# EAGLE design NQSMHS-V2.4 (EAGLE 5.10)

## Sheet 1 of 4
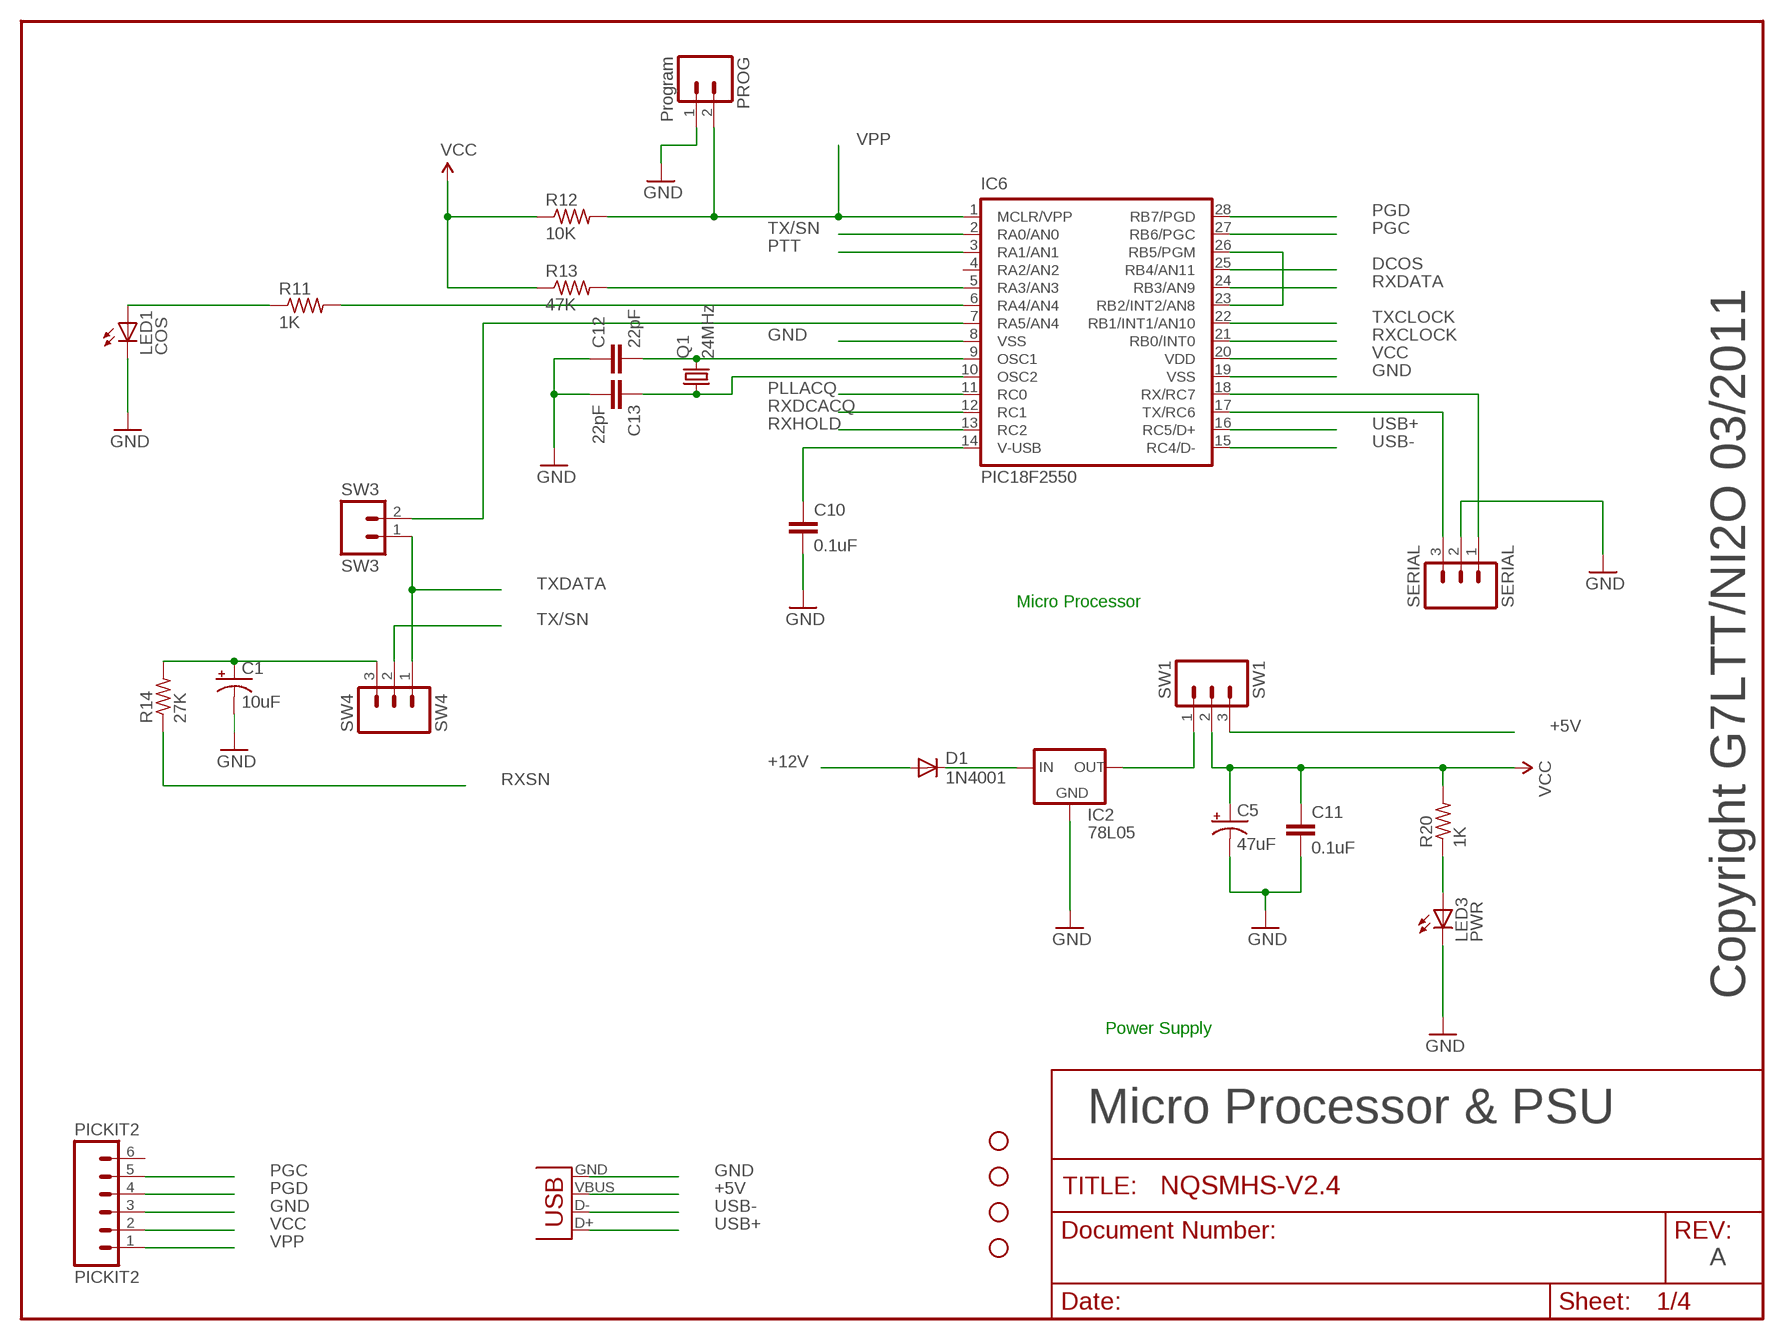
[diagram p0: schematic, sheet 1]

### Parts
C1  10uF  CAP_POLPTH2  [CPOL-RADIAL-10UF-25V]
C5  47uF  CAP_POLPTH2  [CPOL-RADIAL-10UF-25V]
C10  0.1uF  C2.5/2  [C2.5-2]
C11  0.1uF  C2.5/2  [C2.5-2]
C12  22pF  C2.5/2  [C2.5-2]
C13  22pF  C2.5/2  [C2.5-2]
D1  1N4001  DIODEPTH  [DIODE-1N4001]
IC2  78L05  78LXX  [78LXX]
IC6  PIC18F2550  [DIL28-3]
J1  USBPTH  [USB-B-PTH]
JP7  STAND-OFF  [STAND-OFF]
JP8  STAND-OFF  [STAND-OFF]
JP9  STAND-OFF  [STAND-OFF]
JP10  STAND-OFF  [STAND-OFF]
LED1  COS  LED5MM  [LED5MM]
LED3  PWR  LED5MM  [LED5MM]
PICKIT2  PICKIT2  M06SIP  [1X06]
PROG  Program  M02PTH  [1X02]
Q1  24MHz  CRYSTALHC49US  [HC49US]
R11  1K  R-US_0207/2V  [0207/2V]
R12  10K  R-US_0207/2V  [0207/2V]
R13  47K  R-US_0207/2V  [0207/2V]
R14  27K  R-US_0207/2V  [0207/2V]
R20  1K  R-US_0207/2V  [0207/2V]
SERIAL  SERIAL  M03PTH  [1X03]
SW1  SW1  M03PTH  [1X03]
SW3  SW3  M02PTH  [1X02]
SW4  SW4  M03PTH  [1X03]

### Nets
+5V: J1.VBUS SW1.3
+12V: D1.A ; also sheet 2
DCOS: IC6.25(RB4/AN11) ; also sheet 3
GND: C1.2(-) C5.2(-) C10.2 C11.2 C12.1 C13.2 IC2.GND IC6.8(VSS) IC6.19(VSS) J1.GND LED1.K(C) LED3.K(C) PICKIT2.3 PROG.1 SERIAL.2 ; also sheet 2,3,4
N$2: D1.C IC2.IN
N$3: IC6.23(RB2/INT2/AN8) IC6.26(RB5/PGM)
N$4: IC6.5(RA3/AN3) R13.2
N$5: IC6.6(RA4/AN4) R11.2
N$6: LED1.A R11.1
N$7: IC6.7(RA5/AN4) SW3.2
N$8: C1.1(+) R14.2 SW4.3
N$9: C12.2 IC6.9(OSC1) Q1.2
N$10: C13.1 IC6.10(OSC2) Q1.1
N$11: C10.1 IC6.14(V-USB)
N$12: IC2.OUT SW1.1
N$13: LED3.A R20.1
PGC: IC6.27(RB6/PGC) PICKIT2.5
PGD: IC6.28(RB7/PGD) PICKIT2.4
PLLACQ: IC6.11(RC0) ; also sheet 4
PTT: IC6.3(RA1/AN1) ; also sheet 2
RX-232: IC6.18(RX/RC7) SERIAL.1
RXCLOCK: IC6.21(RB0/INT0) ; also sheet 4
RXDATA: IC6.24(RB3/AN9) ; also sheet 4
RXDCACQ: IC6.12(RC1) ; also sheet 4
RXHOLD: IC6.13(RC2) ; also sheet 4
RXSN: R14.1 ; also sheet 3,4
TX-232: IC6.17(TX/RC6) SERIAL.3
TX/SN: IC6.2(RA0/AN0) SW4.2
TXCLOCK: IC6.22(RB1/INT1/AN10) ; also sheet 4
TXDATA: SW3.1 SW4.1 ; also sheet 4
USB+: IC6.16(RC5/D+) J1.D+
USB-: IC6.15(RC4/D-) J1.D-
VCC: C5.1(+) C11.1 IC6.20(VDD) PICKIT2.2 R12.1 R13.1 R20.2 SW1.2 ; also sheet 2,3,4
VPP: IC6.1(MCLR/VPP) PICKIT2.1 PROG.2 R12.2
Unconnected: IC6.4(RA2/AN2) PICKIT2.6

### Notes on the sheet
- Micro Processor
- Copyright G7LTT/NI2O 03/2011
- Power Supply
- Micro Processor & PSU
- A

## Sheet 2 of 4
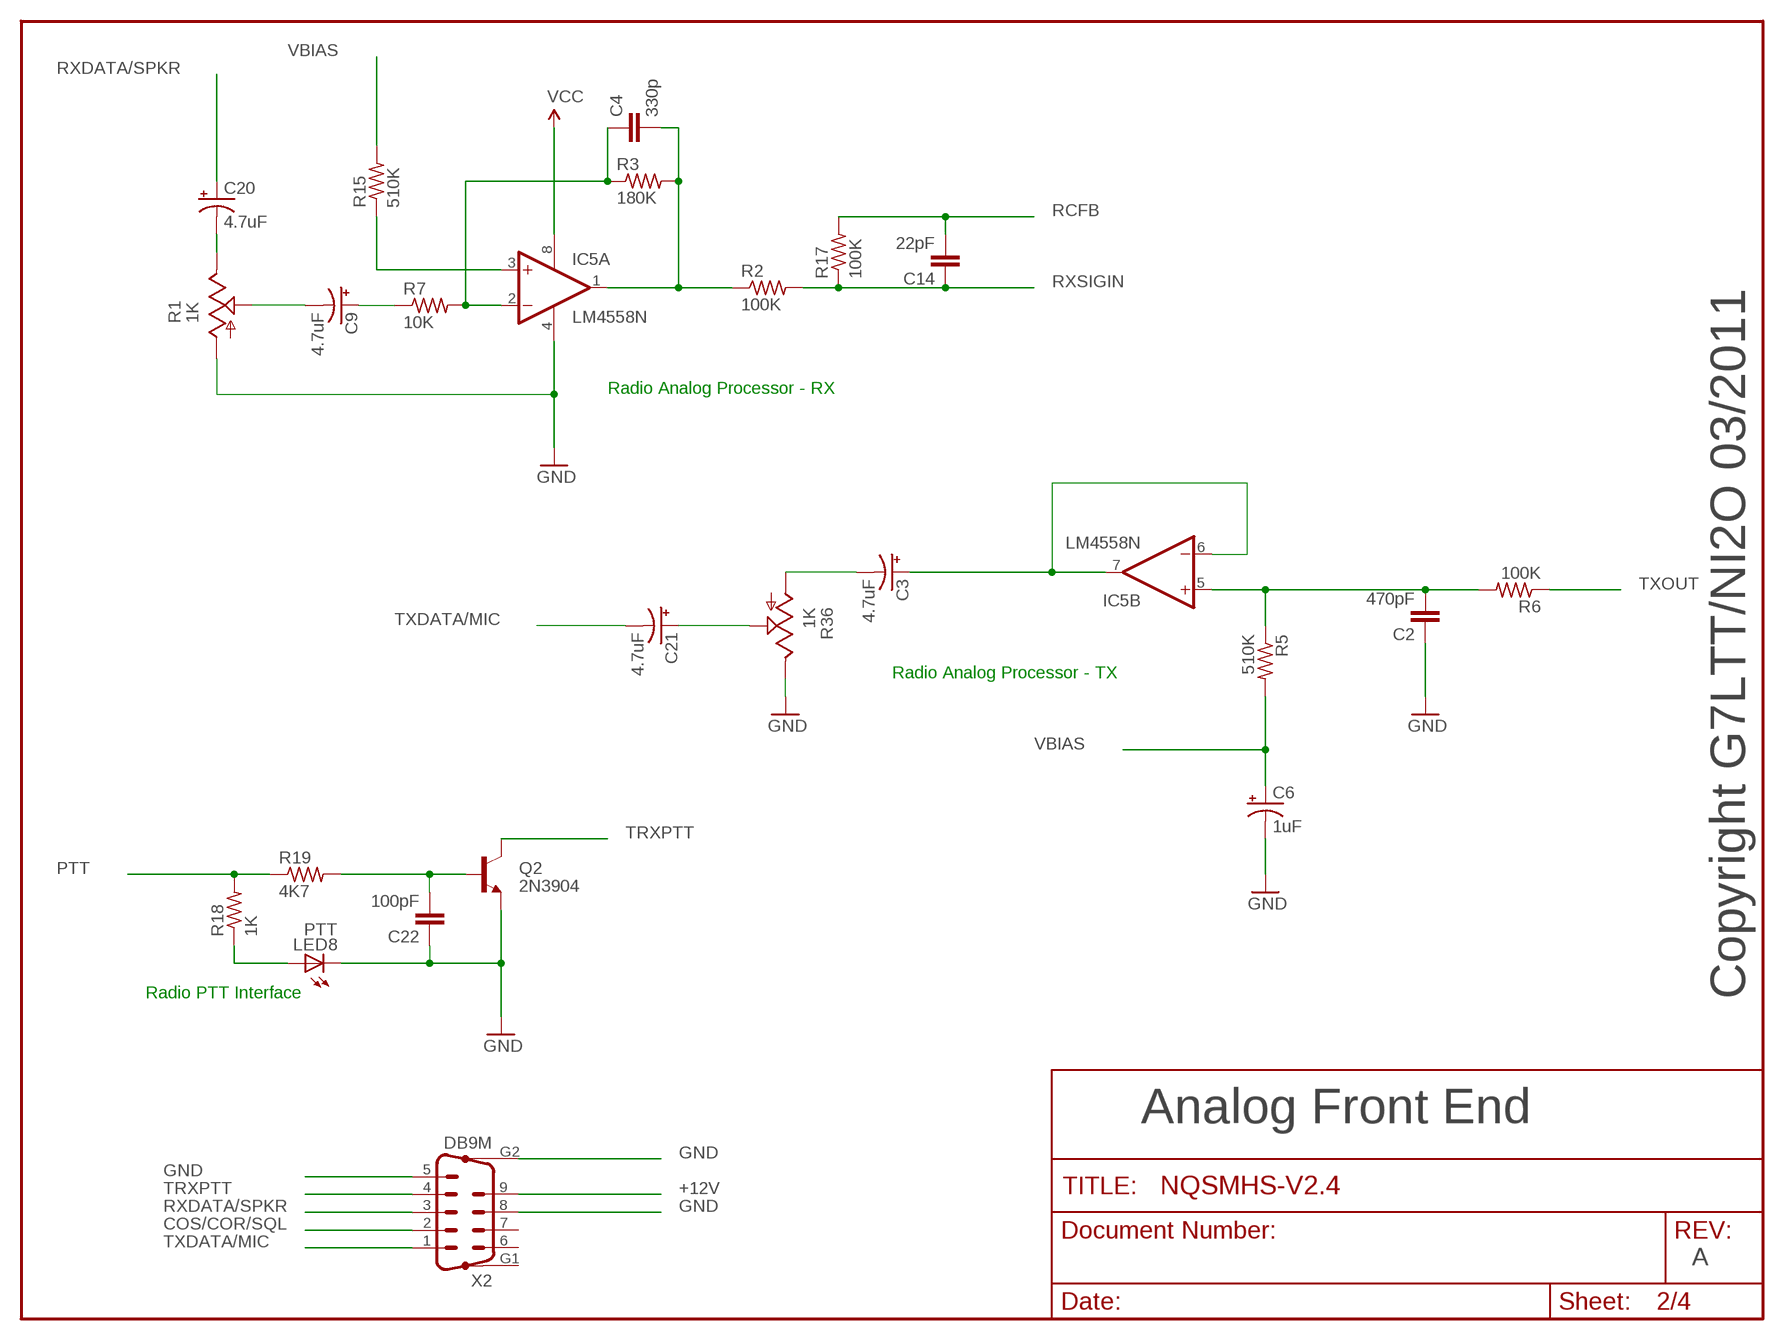
[diagram p1: schematic, sheet 2]

### Parts
C2  470pF  C2.5/2  [C2.5-2]
C3  4.7uF  CAP_POLPTH2  [CPOL-RADIAL-10UF-25V]
C4  330p  C2.5/2  [C2.5-2]
C6  1uF  CAP_POLPTH2  [CPOL-RADIAL-10UF-25V]
C9  4.7uF  CAP_POLPTH2  [CPOL-RADIAL-10UF-25V]
C14  22pF  C2.5/2  [C2.5-2]
C20  4.7uF  CAP_POLPTH2  [CPOL-RADIAL-10UF-25V]
C21  4.7uF  CAP_POLPTH2  [CPOL-RADIAL-10UF-25V]
C22  100pF  C2.5/2  [C2.5-2]
IC5  LM4558N  [DIL08]
LED8  PTT  LED5MM  [LED5MM]
Q2  2N3904  TRANSISTOR_NPNTO92  [TO-92]
R1  1K  TRIM_US-CA6V  [CA6V]
R2  100K  R-US_0207/2V  [0207/2V]
R3  180K  R-US_0207/2V  [0207/2V]
R5  510K  R-US_0207/2V  [0207/2V]
R6  100K  R-US_0207/2V  [0207/2V]
R7  10K  R-US_0207/2V  [0207/2V]
R15  510K  R-US_0207/2V  [0207/2V]
R17  100K  R-US_0207/2V  [0207/2V]
R18  1K  R-US_0207/2V  [0207/2V]
R19  4K7  R-US_0207/2V  [0207/2V]
R36  1K  TRIM_US-CA6V  [CA6V]
X2  DB9M  M09HP  [M09HP]

### Nets
+12V: X2.9 ; also sheet 1
COS/COR/SQL: X2.2
GND: C2.1 C6.2(-) C22.1 IC5.4(P:V-) LED8.K(C) Q2.1(E) R1.A R36.E X2.5 X2.8 X2.G2 ; also sheet 1,3,4
N$15: C22.2 Q2.2(B) R19.2
N$17: LED8.A R18.1
N$18: C9.2(-) R1.S
N$19: C3.1(+) IC5.6(B:-IN) IC5.7(B:OUT)
N$20: C9.1(+) R7.1
N$23: C4.2 IC5.1(A:OUT) R2.1 R3.2
N$25: C2.2 IC5.5(B:+IN) R5.1 R6.2
N$26: C4.1 IC5.2(A:-IN) R3.1 R7.2
N$28: C3.2(-) R36.A
N$29: C21.1(+) R36.S
N$37: C20.2(-) R1.E
N$40: IC5.3(A:+IN) R15.1
PTT: R18.2 R19.1 ; also sheet 1
RCFB: C14.2 R17.2 ; also sheet 4
RXDATA/SPKR: C20.1(+) X2.3
RXSIGIN: C14.1 R2.2 R17.1 ; also sheet 4
TRXPTT: Q2.3(C) X2.4
TXDATA/MIC: C21.2(-) X2.1
TXOUT: R6.1 ; also sheet 4
VBIAS: C6.1(+) R5.2 R15.2 ; also sheet 4
VCC: IC5.8(P:V+) ; also sheet 1,3,4
Unconnected: X2.6 X2.7 X2.G1

### Notes on the sheet
- Radio Analog Processor - RX
- Radio Analog Processor - TX
- Radio PTT Interface | Copyright G7LTT/NI2O 03/2011
- Analog Front End
- A

## Sheet 3 of 4
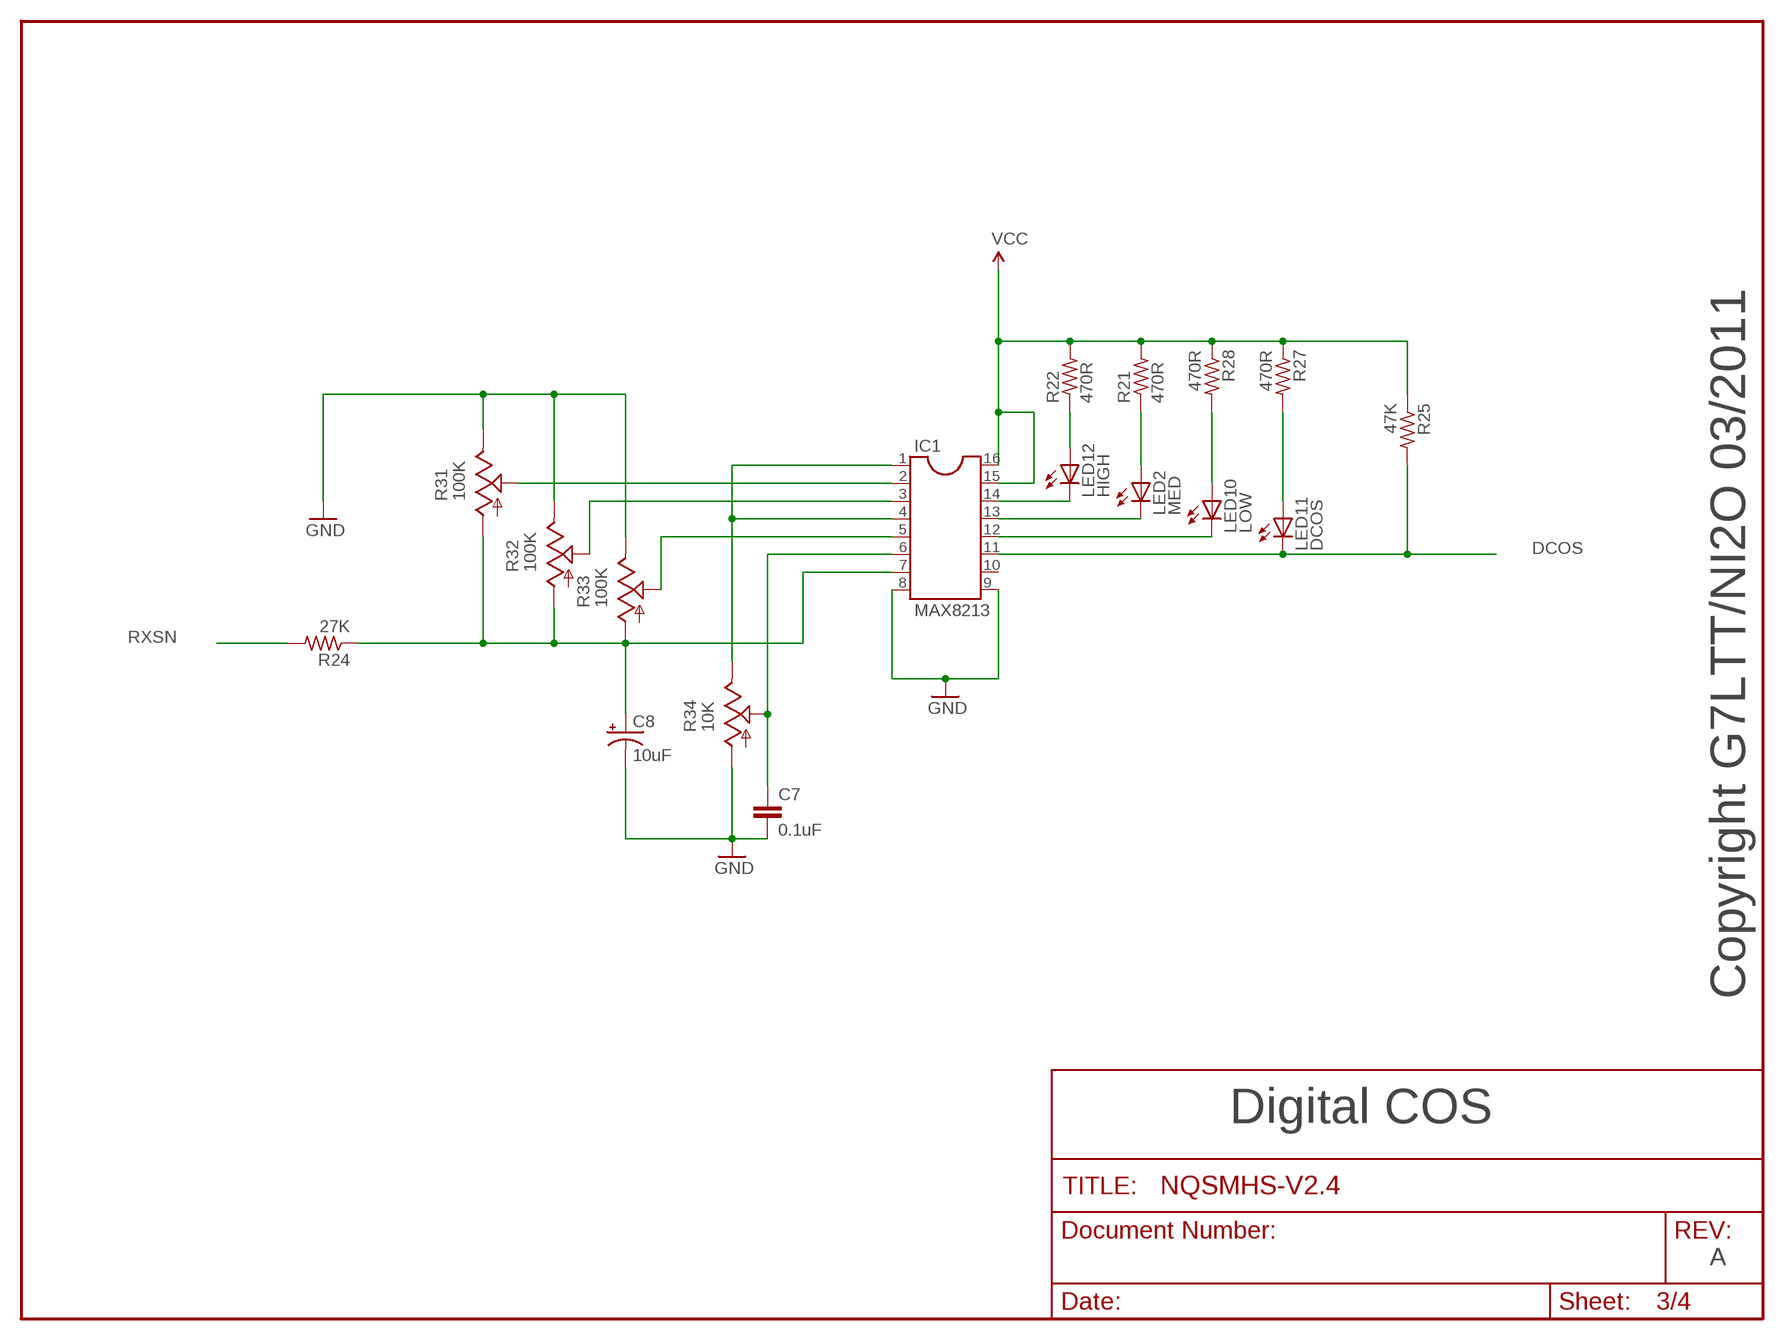
[diagram p2: schematic, sheet 3]

### Parts
C7  0.1uF  C2.5/2  [C2.5-2]
C8  10uF  CAP_POLPTH2  [CPOL-RADIAL-10UF-25V]
IC1  MAX8213  DIL16  [DIL16]
LED2  MED  LED5MM  [LED5MM]
LED10  LOW  LED5MM  [LED5MM]
LED11  DCOS  LED5MM  [LED5MM]
LED12  HIGH  LED5MM  [LED5MM]
R21  470R  R-US_0207/2V  [0207/2V]
R22  470R  R-US_0207/2V  [0207/2V]
R24  27K  R-US_0207/2V  [0207/2V]
R25  47K  R-US_0207/2V  [0207/2V]
R27  470R  R-US_0207/2V  [0207/2V]
R28  470R  R-US_0207/2V  [0207/2V]
R31  100K  TRIM_US-CA6V  [CA6V]
R32  100K  TRIM_US-CA6V  [CA6V]
R33  100K  TRIM_US-CA6V  [CA6V]
R34  10K  TRIM_US-CA6V  [CA6V]

### Nets
DCOS: IC1.11 LED11.K(C) R25.2 ; also sheet 1
GND: C7.2 C8.2(-) IC1.8 IC1.9 R31.E R32.E R33.E R34.A ; also sheet 1,2,4
N$14: C7.1 IC1.6 R34.S
N$16: IC1.14 LED12.K(C)
N$41: LED12.A R22.1
N$44: IC1.13 LED2.K(C)
N$45: LED2.A R21.1
N$46: IC1.12 LED10.K(C)
N$47: LED11.A R27.2
N$48: LED10.A R28.2
N$49: IC1.2 R31.S
N$50: IC1.3 R32.S
N$51: IC1.5 R33.S
N$52: IC1.1 IC1.4 R34.E
N$53: C8.1(+) IC1.7 R24.1 R31.A R32.A R33.A
RXSN: R24.2 ; also sheet 1,4
VCC: IC1.15 IC1.16 R21.2 R22.2 R25.1 R27.1 R28.1 ; also sheet 1,2,4
Unconnected: IC1.10

### Notes on the sheet
- Copyright G7LTT/NI2O 03/2011
- Digital COS
- A

## Sheet 4 of 4
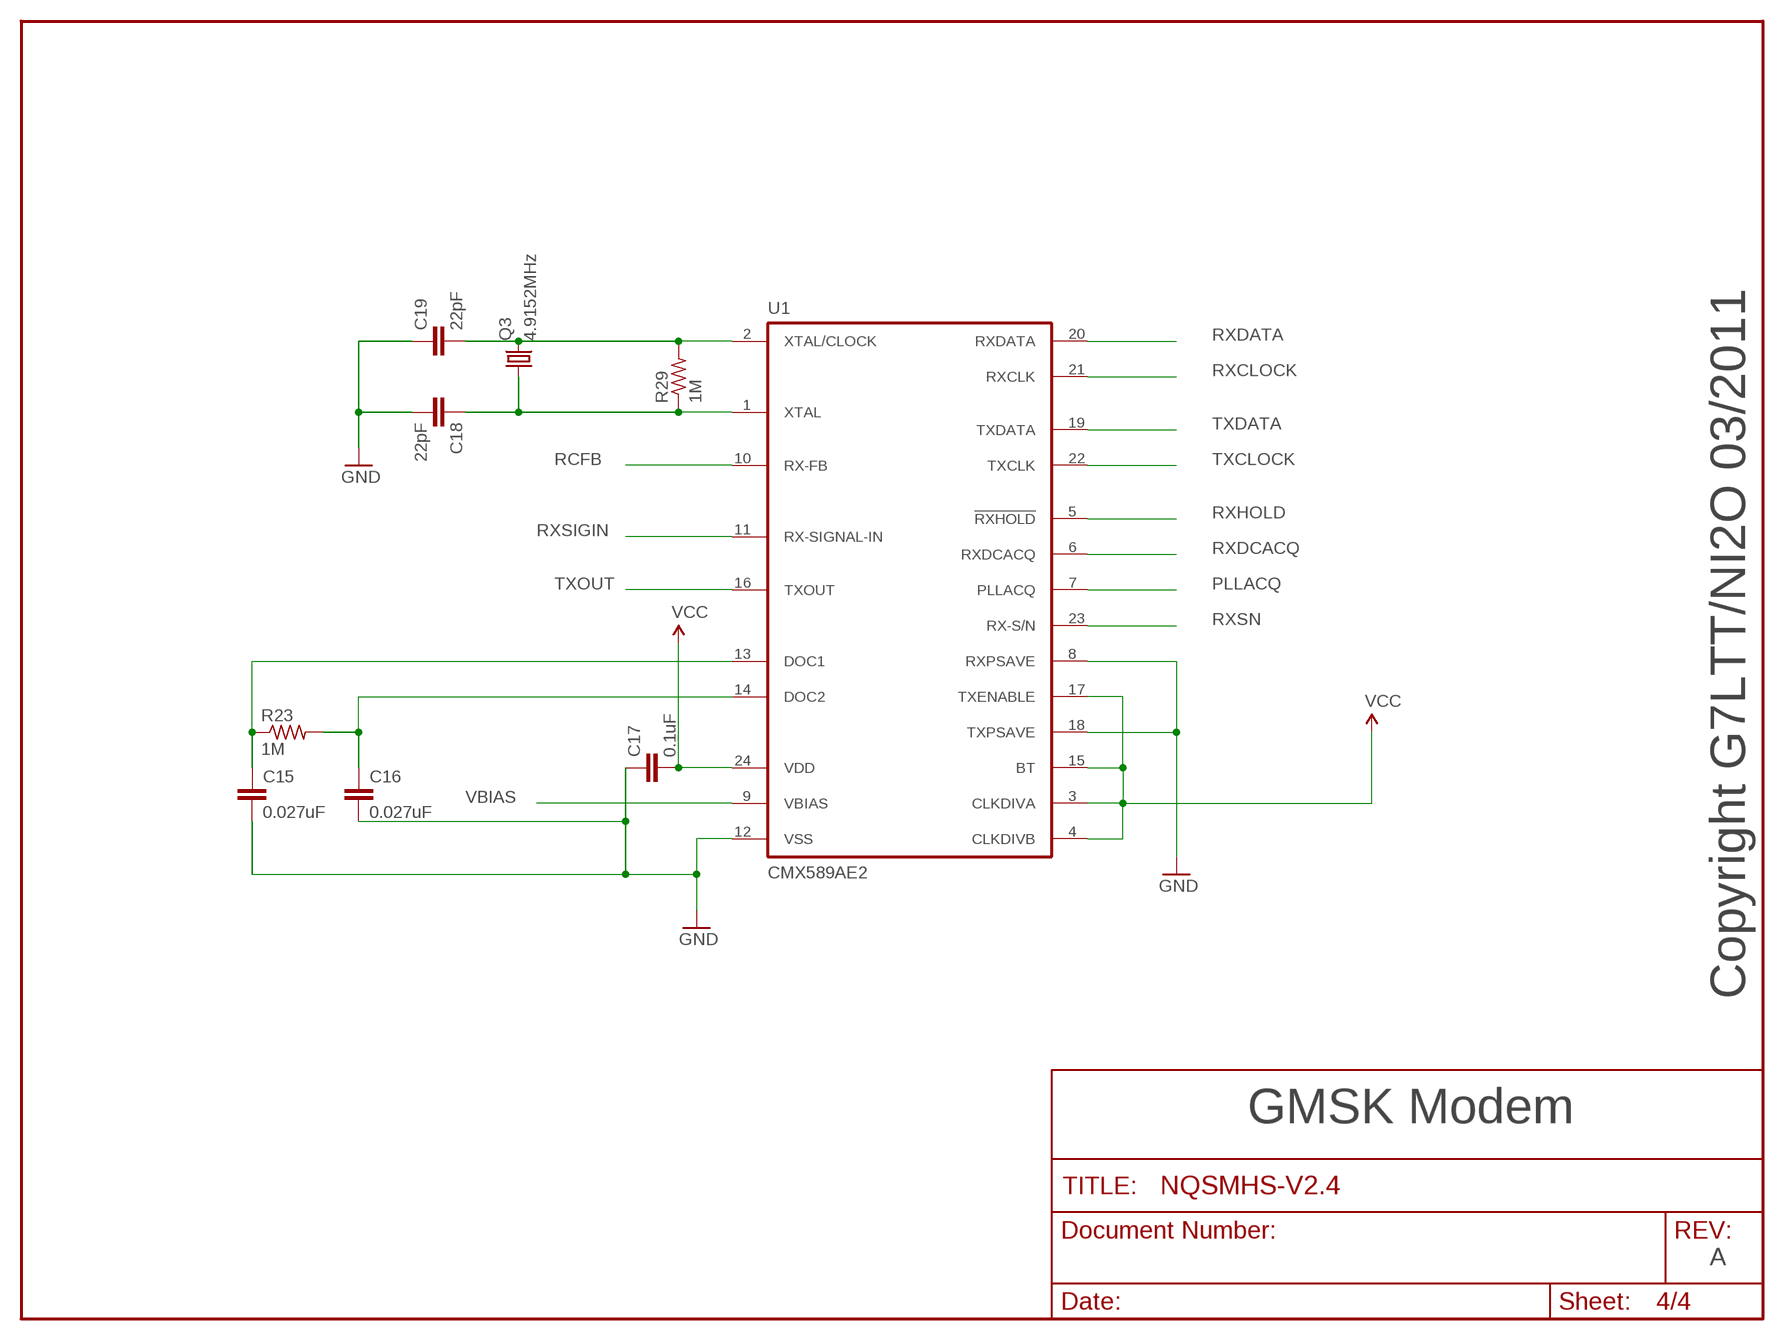
[diagram p3: schematic, sheet 4]

### Parts
C15  0.027uF  C2.5/2  [C2.5-2]
C16  0.027uF  C2.5/2  [C2.5-2]
C17  0.1uF  C2.5/2  [C2.5-2]
C18  22pF  C2.5/2  [C2.5-2]
C19  22pF  C2.5/2  [C2.5-2]
Q3  4.9152MHz  CRYSTALHC49US  [HC49US]
R23  1M  R-US_0207/2V  [0207/2V]
R29  1M  R-US_0207/2V  [0207/2V]
U1  CMX589AE2  [TSSOP24]

### Nets
GND: C15.2 C16.2 C17.1 C18.2 C19.1 U1.8(RXPSAVE) U1.12(VSS) U1.18(TXPSAVE) ; also sheet 1,2,3
N$1: C15.1 R23.1 U1.13(DOC1)
N$21: C16.1 R23.2 U1.14(DOC2)
N$22: C18.1 Q3.1 R29.1 U1.1(XTAL)
N$24: C19.2 Q3.2 R29.2 U1.2(XTAL/CLOCK)
PLLACQ: U1.7(PLLACQ) ; also sheet 1
RCFB: U1.10(RX-FB) ; also sheet 2
RXCLOCK: U1.21(RXCLK) ; also sheet 1
RXDATA: U1.20(RXDATA) ; also sheet 1
RXDCACQ: U1.6(RXDCACQ) ; also sheet 1
RXHOLD: U1.5(!RXHOLD!) ; also sheet 1
RXSIGIN: U1.11(RX-SIGNAL-IN) ; also sheet 2
RXSN: U1.23(RX-S/N) ; also sheet 1,3
TXCLOCK: U1.22(TXCLK) ; also sheet 1
TXDATA: U1.19(TXDATA) ; also sheet 1
TXOUT: U1.16(TXOUT) ; also sheet 2
VBIAS: U1.9(VBIAS) ; also sheet 2
VCC: C17.2 U1.3(CLKDIVA) U1.4(CLKDIVB) U1.15(BT) U1.17(TXENABLE) U1.24(VDD) ; also sheet 1,2,3

### Notes on the sheet
- Copyright G7LTT/NI2O 03/2011
- GMSK Modem
- A

## Library data of the parts
C1 C3 C5 C6 C8 C9 C20 C21 = SparkFun:CAP_POL: Capacitor Polarized These are standard SMD and PTH capacitors. Normally 10uF, 47uF, and 100uF in electrolytic and tantalum varieties. Always verify the external diameter of the through hole cap, it varies with capacity, voltage, and manufacturer. The EIA devices should be standard.
C2 C4 C7 C10-C19 C22 = capacitor-wima:C: CAPACITOR naming: grid - package width
D1 = SparkFun:DIODE: Diode These are standard reverse protection diodes and small signal diodes. SMA package can handle up to about 1A. SOD-323 can handle about 200mA. What the SOD-323 package when ordering, there are some mfgs out there that are 5-pin packages.
IC1 = ic-package:DIL16: Dual In Line / Socket
IC2 = v-reg:78LXX: VOLTAGE REGULATOR
IC5 = linear:*4558: OP AMP
IC6 = SparkFun:PIC18F2550
J1 = SparkFun:USB: USB Connectors USB-B-PTH is fully proven SKU : PRT-00139 USB-miniB is fully proven SKU : PRT-00587 USB-A-PCB is untested. USB-A-H is throughly reviewed, but untested. Spark Fun Electronics SKU : PRT-00437 USB-B-SMT is throughly reviewed, but untested. Needs silkscreen touching up. USB-A-S has not been used/tested USB-MB-H has not been used/tested
JP7-JP10 = SparkFun:STAND-OFF: Stand Off This is the mechanical footprint for a #4 phillips button head screw. Use the keepout ring to avoid running the screw head into surrounding components. SKU : PRT-00447
LED1-LED3 LED8 LED10-LED12 = SparkFun:LED: LEDs Standard schematic elements and footprints for 5mm, 3mm, 1206, and 0603 sized LEDs. 5mm - Spark Fun Electronics SKU : COM-00529 (and others)
PICKIT2 = SparkFun:M06: Header 6 Standard 6-pin 0.1" header. Use with straight break away headers (SKU : PRT-00116), right angle break away headers (PRT-00553), swiss pins (PRT-00743), machine pins (PRT-00117), and female headers (PRT-00115). Molex polarized connector foot print use with SKU : PRT-08094 with associated crimp pins and housings. NOTES ON THE VARIANTS LOCK and LOCK_LONGPADS... This footprint was designed to help hold the alignment of a through-hole component (i.e. 6-pin header) while soldering it into place. You may notice that each hole has been shifted either up or down by 0.005 of an inch from it's more standard position (which is a perfectly straight line). This slight alteration caused the pins (the squares in the middle) to touch the edges of the holes. Because they are alternating, it causes a "brace" to hold the component in place. 0.005 has proven to be the perfect amount of "off-center" position when using our standard breakaway headers. Although looks a little odd when you look at the bare footprint, once you have a header in there, the alteration is very hard to notice. Also, if you push a header all the way into place, it is covered up entirely on the bottom side. This idea of altering the position of holes to aid alignment will be further integrated into the Sparkfun Library for other footprints. It can help hold any component with 3 or more connection pins.
PROG SW3 = SparkFun:M02: Header 2 Standard 2-pin 0.1" header. Use with straight break away headers (SKU : PRT-00116), right angle break away headers (PRT-00553), swiss pins (PRT-00743), machine pins (PRT-00117), and female headers (PRT-00115). Molex polarized connector foot print use with SKU : PRT-08233 with associated crimp pins and housings.
Q1 Q3 = SparkFun:CRYSTAL: Crystals Various standard crystals. Proven footprints. Spark Fun Electronics SKU : COM-00534
Q2 = SparkFun:TRANSISTOR_NPN: Transistor NPN BJT configuration in SOT23 package. MMBT2222 is the common NPN we use. Double check BCE configuration again layout.
R1 R31-R34 R36 = pot:TRIM_US-: POTENTIOMETER
R2 R3 R5-R7 R11-R15 R17-R25 R27-R29 = resistor:R-US_: RESISTOR, American symbol
SERIAL SW1 SW4 = SparkFun:M03: Header 3 Standard 3-pin 0.1" header. Use with straight break away headers (SKU : PRT-00116), right angle break away headers (PRT-00553), swiss pins (PRT-00743), machine pins (PRT-00117), and female headers (PRT-00115). Molex polarized connector foot print use with SKU : PRT-08232 with associated crimp pins and housings.
U1 = cml-micro:CMX589A: HIGH-SPEED GMSK MODEM
X2 = con-subd:M09HP: SUB-D

## Board
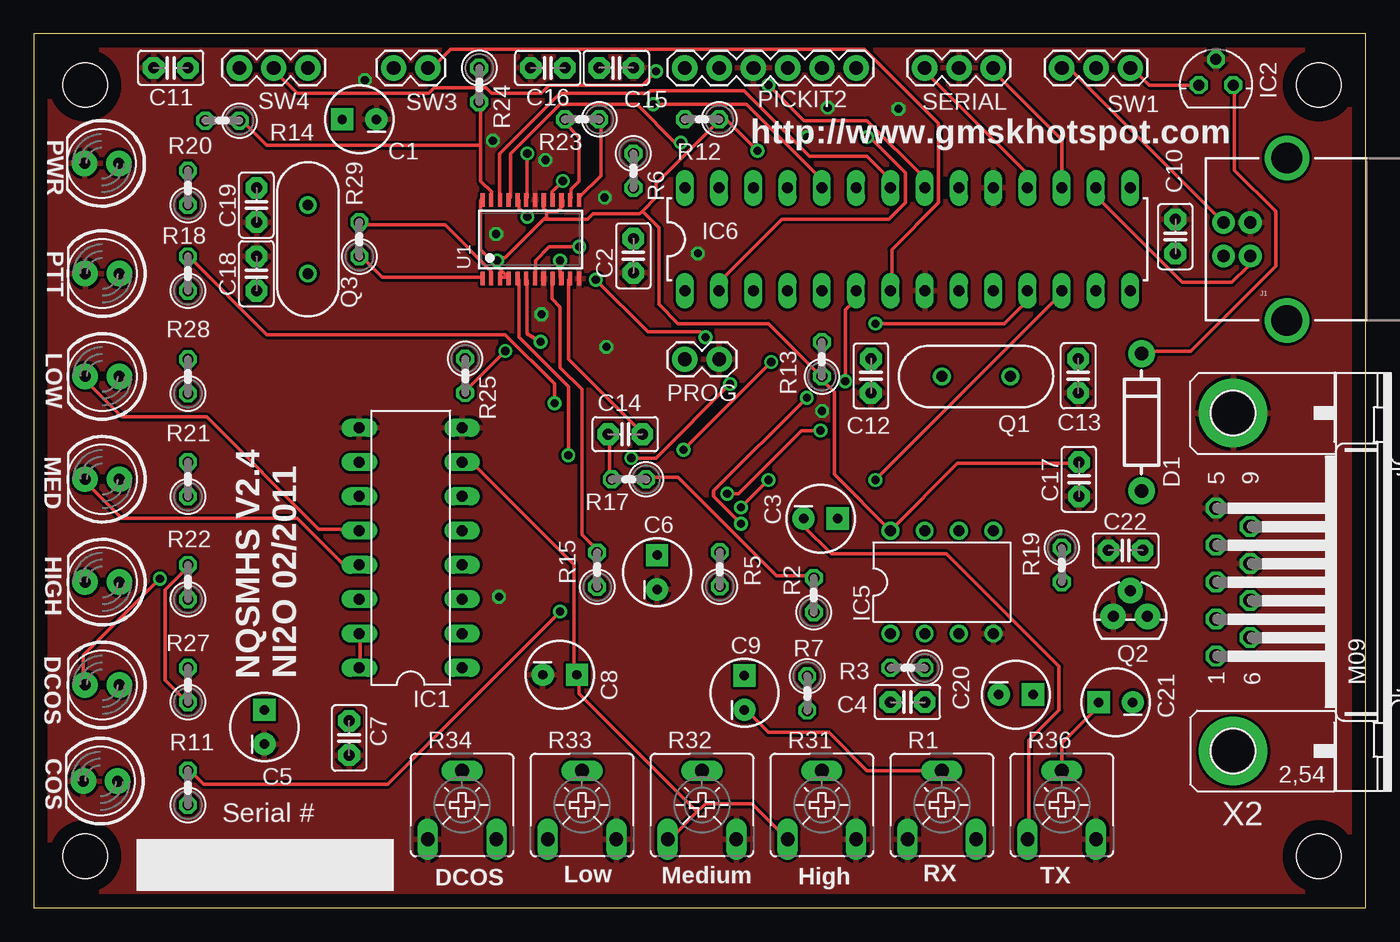
[diagram p4: board, top side]
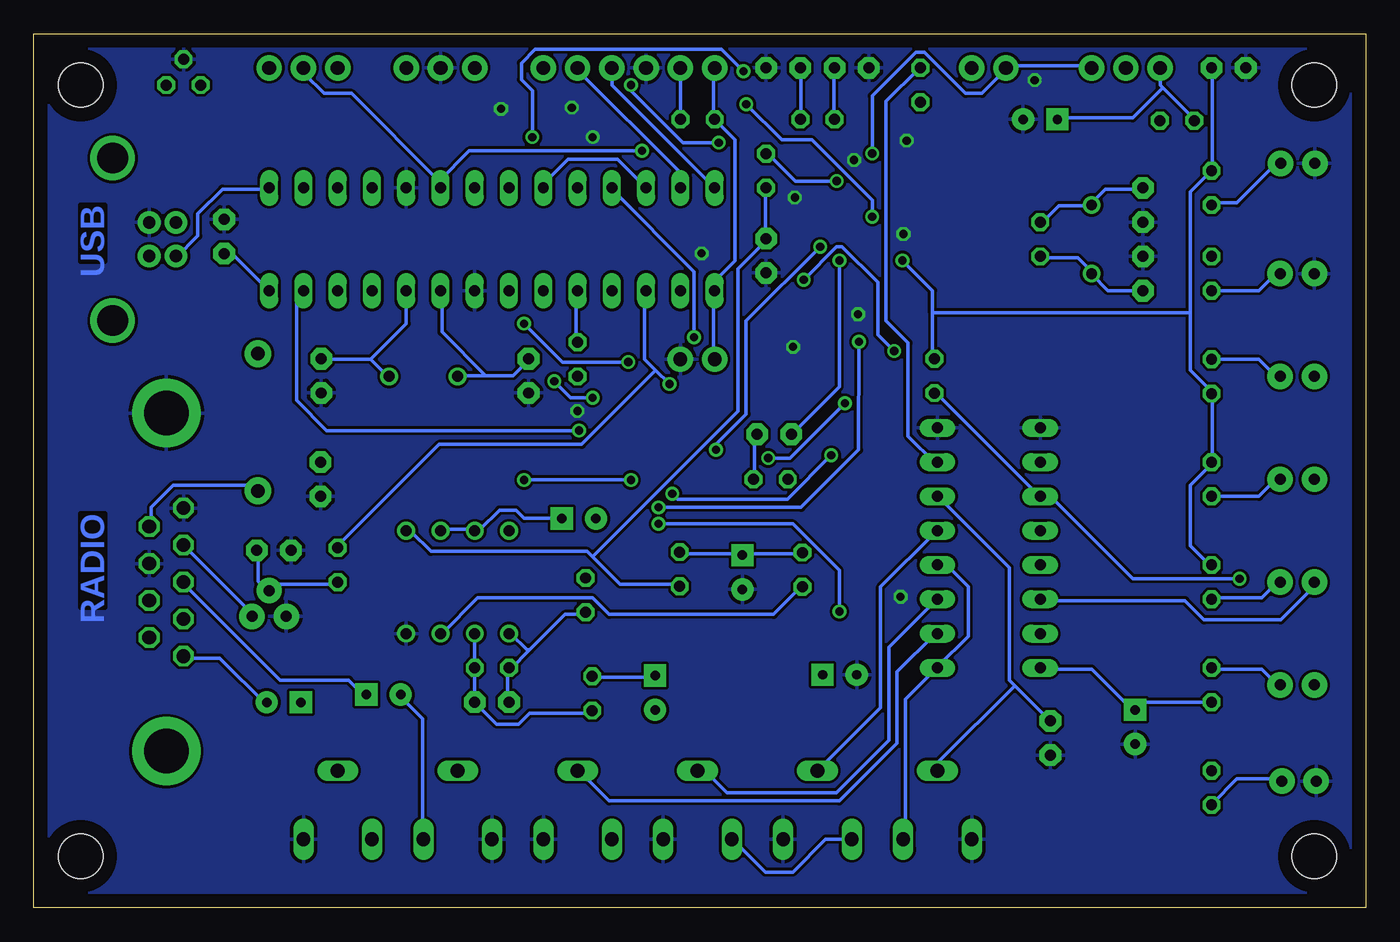
[diagram p5: board, bottom side, seen from below]

Size 98.73 x 64.76 mm. Coordinates in mm from the lower left corner, seen from the top.
Outline: 98.73,0 98.73,64.76 0,64.76 0,0 98.73,0
Copper layers (1*16): Top 0.035mm / dielectric 1.5mm / Bottom 0.035mm
Design rules "default": minimum track width 10mil, minimum drill 24mil, track to track 8mil, track to pad 8mil, pad to pad 8mil, via to via 8mil, smd to smd 8mil, copper to edge 40mil, drill to drill 8mil, minimum pad ring 10mil, minimum via ring 8mil, stop-mask expansion 4mil, vias tented up to drill 0mil, thermal gap 10mil

### Footprints (pad centres in the part's own frame; a part is rotated, then mirrored left to right if it is on the bottom)
CPOL-RADIAL-10UF-25V = drill 0.7 pad 1.651 square: 1 1.27,0 | drill 0.7 pad 1.651 round: 2 -1.27,0
C2.5-2 = drill 0.813 pad 1.6 octagon: 1 -1.27,0; 2 1.27,0
DIODE-1N4001 = drill 1 pad 1.981 round: A -5.08,0; C 5.08,0
DIL16 = drill 0.813 long: 1 -8.89,-3.81; 2 -6.35,-3.81; 3 -3.81,-3.81; 4 -1.27,-3.81; 5 1.27,-3.81; 6 3.81,-3.81; 7 6.35,-3.81; 8 8.89,-3.81; 9 8.89,3.81; 10 6.35,3.81; 11 3.81,3.81; 12 1.27,3.81; 13 -1.27,3.81; 14 -3.81,3.81; 15 -6.35,3.81; 16 -8.89,3.81
78LXX = drill 0.813 octagon: GND 0,1.905; IN 1.27,0; OUT -1.27,0
DIL08 = drill 0.813 pad 1.27 round: 1 -3.81,-3.81; 2 -1.27,-3.81; 3 1.27,-3.81; 4 3.81,-3.81; 5 3.81,3.81; 6 1.27,3.81; 7 -1.27,3.81; 8 -3.81,3.81
DIL28-3 = drill 0.813 long: 1 -16.51,-3.81; 2 -13.97,-3.81; 3 -11.43,-3.81; 4 -8.89,-3.81; 5 -6.35,-3.81; 6 -3.81,-3.81; 7 -1.27,-3.81; 8 1.27,-3.81; 9 3.81,-3.81; 10 6.35,-3.81; 11 8.89,-3.81; 12 11.43,-3.81; 13 13.97,-3.81; 14 16.51,-3.81; 15 16.51,3.81; 16 13.97,3.81; 17 11.43,3.81; 18 8.89,3.81; 19 6.35,3.81; 20 3.81,3.81; 21 1.27,3.81; 22 -1.27,3.81; 23 -3.81,3.81; 24 -6.35,3.81; 25 -8.89,3.81; 26 -11.43,3.81; 27 -13.97,3.81; 28 -16.51,3.81
USB-B-PTH = drill 0.914 pad 1.676 round: D+ 0,1.25; D- 1.981,1.25; GND 0,-1.25; VBUS 1.981,-1.25 | drill 2.286 round: P$1 -2.718,-6.02; P$2 -2.718,6.02
STAND-OFF = hole 3.302: 0,0
LED5MM = drill 0.813 pad 1.88 round: A -1.27,0; K 1.27,0
1X06 = drill 1.016 pad 1.88 round: 1 0,0; 2 2.54,0; 3 5.08,0; 4 7.62,0; 5 10.16,0; 6 12.7,0
1X02 = drill 1.016 pad 1.88 round: 1 0,0; 2 2.54,0
HC49US = drill 0.813 round: 1 -2.54,0; 2 2.54,0
TO-92 = drill 0.813 pad 1.88 round: 1 -1.27,0; 2 0,1.905; 3 1.27,0
CA6V = drill 1.016 long: A -2.54,-2.54; E 2.54,-2.54; S 0,2.54
0207/2V = drill 0.813 octagon: 1 -1.27,0; 2 1.27,0
1X03 = drill 1.016 pad 1.88 round: 1 0,0; 2 2.54,0; 3 5.08,0
TSSOP24 = smd 0.305 x 0.991: 1 -3.575,-2.918; 2 -2.925,-2.918; 3 -2.275,-2.918; 4 -1.625,-2.918; 5 -0.975,-2.918; 6 -0.325,-2.918; 7 0.325,-2.918; 8 0.975,-2.918; 9 1.625,-2.918; 10 2.275,-2.918; 11 2.925,-2.918; 12 3.575,-2.918; 13 3.575,2.918; 14 2.925,2.918; 15 2.275,2.918; 16 1.625,2.918; 17 0.975,2.918; 18 0.325,2.918; 19 -0.325,2.918; 20 -0.975,2.918; 21 -1.625,2.918; 22 -2.275,2.918; 23 -2.925,2.918; 24 -3.575,2.918
M09HP = drill 1.016 octagon: 1 -5.486,1.27; 2 -2.743,1.27; 3 0,1.27; 4 2.743,1.27; 5 5.486,1.27; 6 -4.115,-1.27; 7 -1.372,-1.27; 8 1.372,-1.27; 9 4.115,-1.27 | drill 3.302 pad 5.08 round: G1 -12.522,0; G2 12.522,0

### Placement (x,y rotation side)
C1  24.13,58.42 180 top
C2  44.45,48.3 90 top
C3  58.33,28.83 0 top
C4  64.77,15.24 180 top
C5  17.09,13.4 90 top
C6  46.2,24.86 90 top
C7  23.38,12.58 270 top
C8  38.99,17.26 0 top
C9  52.68,15.93 90 top
C10  84.62,49.74 90 top
C11  10.16,62.23 180 top
C12  62.05,39.41 90 top
C13  77.42,39.41 270 top
C14  43.84,35.09 180 top
C15  43.18,62.23 0 top
C16  38.1,62.23 180 top
C17  77.47,31.75 90 top
C18  16.51,46.99 90 top
C19  16.51,52.07 90 top
C20  72.8,15.79 0 top
C21  80.19,15.22 180 top
C22  80.93,26.47 0 top
D1  82.11,35.98 90 top
IC1  27.94,26.67 90 top
IC2  87.63,60.96 0 top
IC5  67.31,24.13 0 top
IC6  64.77,49.53 0 top
J1  90.17,49.53 180 top
JP7  3.81,3.81 0 top
JP8  95.25,3.81 0 top
JP9  3.81,60.96 0 top
JP10  95.25,60.96 0 top
LED1  4.94,9.39 180 top
LED2  5.08,31.75 180 top
LED3  5.03,55.16 180 top
LED8  5.08,46.99 180 top
LED10  5.08,39.37 180 top
LED11  5.08,16.51 180 top
LED12  5.08,24.13 180 top
PICKIT2  48.26,62.23 0 top
PROG  50.8,40.64 180 top
Q1  69.85,39.37 180 top
Q2  81.28,21.59 0 top
Q3  20.32,49.53 90 top
R1  67.31,7.62 0 top
R2  57.82,23.16 90 top
R3  64.77,17.78 180 top
R5  50.85,25.09 90 top
R6  44.45,54.61 270 top
R7  57.34,15.89 270 top
R11  11.43,8.89 90 top
R12  49.53,58.42 180 top
R13  58.42,40.64 90 top
R14  13.99,58.32 180 top
R15  41.76,25.05 90 top
R17  44.11,31.75 180 top
R18  11.43,46.99 90 top
R19  76.2,25.4 270 top
R20  11.43,53.34 90 top
R21  11.43,31.75 90 top
R22  11.43,24.13 90 top
R23  40.64,58.42 180 top
R24  33.02,60.96 270 top
R25  31.97,39.41 270 top
R27  11.43,16.51 90 top
R28  11.43,39.37 90 top
R29  24.13,49.53 90 top
R31  58.42,7.62 0 top
R32  49.53,7.62 0 top
R33  40.64,7.62 0 top
R34  31.75,7.62 0 top
R36  76.2,7.62 0 top
SERIAL  66.04,62.23 0 top
SW1  81.28,62.23 180 top
SW3  26.67,62.23 0 top
SW4  20.32,62.23 180 top
U1  36.83,49.53 0 top
X2  88.9,24.13 90 top

### Tracks (layer width: path | path; a pad name or v marks a point on that pad's centre or on a via)
+5V
  Top 0.254: J1.VBUS 88.19,50.8 76.81,62.18 76.2,62.18 SW1.3
+12V
  Bottom 0.254: X2.9 90.02,28.25 90.02,29.67 88.39,31.29 82.5,31.29 82.3,31.09 D1.A
DCOS  (via drill 0.61)
  Top 0.254: v49.78,42.27 49.38,42.67 45.52,42.67 v41.66,46.53 | v34.95,41.25 31.9,38.2 R25.2 | v9.35,24.38 3.66,18.69 3.66,16.66 LED11.K
  Bottom 0.254: R25.2 31.9,38.2 24.18,30.48 IC1.11 23.37,30.48 17.27,24.38 v9.35,24.38 | v49.78,42.27 49.78,47.14 55.88,53.24 IC6.25 | v41.66,46.53 39.22,48.97 38.81,48.97 36.17,46.33 36.17,42.47 v34.95,41.25
GND  (via drill 0.6, 0.61)
  other vias: 42.45,41.56 37.64,43.98 49.22,48.49 34.27,49.92 64.09,59.2 58.85,59.29 42.31,52.63 34.03,56.84 37.93,55.4 57.3,57.1 58.43,36.81 24.54,61.32 34.48,23.04
  pour Bottom: 0,64.77 99.06,64.77 99.06,0 0,0
  pour Top: 0,-0.23 98.65,-0.23 98.65,64.85 0,64.85
N$1
  Top 0.254: U1.13 40.44,52.63 42.06,54.25 42.06,58.32 R23.1
  Bottom 0.254: C15.1 41.86,62.18 41.86,58.52 R23.1
N$2
  Top 0.254: IC2.IN 89,60.96 89,54.66 92.05,51.61 92.05,47.55 85.75,41.25 82.3,41.25 D1.C
N$3
  Bottom 0.254: IC6.26 55.47,55.47 59.13,55.47 60.96,53.65 IC6.23
N$4
  Bottom 0.254: R13.2 58.52,42.06 58.52,45.72 IC6.5
N$5  (via drill 0.61)
  Top 0.254: v39.01,21.95 26.21,9.14 12.6,9.14 11.58,10.16 R11.2 | v52.43,28.45 50.39,30.48 50.39,30.89 v57.3,37.8 | v60.15,39.01 60.15,44.3 60.96,45.11 IC6.6
  Bottom 0.254: v39.01,21.95 39.01,24.99 42.47,28.45 v52.43,28.45 | v57.3,37.8 58.93,37.8 v60.15,39.01
N$6
  Bottom 0.254: R11.1 11.38,7.72 9.55,9.55 6.3,9.55 LED1.A
N$7
  Top 0.254: IC6.7 63.6,45.72 63.6,48.77 67.06,52.22 67.06,58.12 61.57,63.6 30.89,63.6 29.67,62.38 29.26,62.38 SW3.2
N$8
  Bottom 0.254: 15.04,60.76 15.24,60.96 SW4.3 | 15.04,60.76 12.8,58.52 R14.2 | 15.04,60.76 17.27,58.52 22.76,58.52 C1.1
N$9
  Bottom 0.254: 65.23,39.42 63.2,39.42 61.98,40.64 C12.2 | 65.23,39.42 67.26,39.42 Q1.2 | 65.23,39.42 68.48,42.67 68.48,45.72 IC6.9
N$10
  Bottom 0.254: 73.76,40.64 72.54,39.42 Q1.1 | 73.76,40.64 77.22,40.64 C13.1 | IC6.10 71.12,43.28 73.76,40.64
N$11
  Bottom 0.254: IC6.14 83.92,48.36 84.53,48.36 C10.1
N$12
  Top 0.254: IC2.OUT 82.7,60.96 81.28,62.38 SW1.1
N$13
  Bottom 0.254: R20.1 11.38,52.22 9.55,52.22 6.5,55.27 LED3.A
N$14
  Bottom 0.254: 26.01,16.46 23.57,14.02 C7.1 | 26.01,16.46 26.42,16.87 26.42,25.2 31.7,30.48 IC1.6 | 26.01,16.46 31.7,10.77 31.7,10.16 R34.S
N$15
  Bottom 0.254: R19.2 76.2,23.98 80.87,23.98 81.28,23.57 Q2.2 81.28,23.37 82.09,24.18 82.09,26.42 C22.2
N$16
  Bottom 0.254: IC1.14 23.98,22.76 13.41,22.76 11.99,21.34 6.3,21.34 3.66,23.98 LED12.K
N$17
  Bottom 0.254: R18.1 7.92,45.72 6.5,47.14 LED8.A
N$18
  Top 0.254: R1.S 61.77,10.16 58.93,13.01 54.46,13.01 52.83,14.63 C9.2
N$19
  Bottom 0.254: 66.04,28.04 68.48,28.04 IC5.6 | 66.04,28.04 65.63,28.04 64.21,29.46 62.99,29.46 62.38,28.85 59.74,28.85 C3.1 | 66.04,28.04 IC5.7
N$20
  Bottom 0.254: R7.1 57.3,17.07 52.83,17.07 C9.1
N$21
  Top 0.254: U1.14 39.83,52.63 39.83,53.24 40.44,53.85 40.44,57.1 39.22,58.32 R23.2
  Bottom 0.254: C16.1 39.42,62.18 39.42,58.52 R23.2
N$22
  Top 0.254: U1.1 33.12,46.74 25.81,46.74 24.18,48.36 R29.1
  Bottom 0.254: C18.1 19.1,45.72 20.32,46.94 Q3.1 20.32,47.14 21.34,48.16 23.98,48.16 R29.1
N$23
  Bottom 0.254: 61.98,19.1 63.4,17.68 R3.2 63.6,17.68 63.6,15.24 C4.2 | 61.98,19.1 59.33,21.74 57.91,21.74 R2.1 | 61.98,19.1 62.18,19.1 63.4,20.32 IC5.1
N$24
  Top 0.254: U1.2 33.93,46.74 33.93,47.14 30.48,50.6 24.38,50.6 24.18,50.8 R29.2
  Bottom 0.254: C19.2 16.66,53.24 19.3,53.24 20.32,52.22 Q3.2 20.32,52.02 22.76,52.02 23.98,50.8 R29.2
N$25
  Bottom 0.254: R6.2 44.5,53.24 44.5,49.58 C2.2 44.5,49.38 46.53,47.35 46.53,36.78 57.3,26.01 | 57.3,26.01 57.71,26.42 69.29,26.42 70.71,27.84 71.12,27.84 IC5.5 | 57.3,26.01 55.27,23.98 51,23.98 R5.1
N$26
  Bottom 0.254: R7.2 57.51,14.43 61.98,14.43 62.79,13.61 64.41,13.61 C4.1 R3.1 IC5.2
N$28
  Top 0.254: R36.A 73.76,5.08 73.76,12.39 76,14.63 76,17.88 67.67,26.21 59.13,26.21 57.1,28.25 57.1,28.65 C3.2
N$29
  Top 0.254: R36.S 76.2,12.19 79.05,15.04 C21.1
N$37
  Bottom 0.254: R1.E 69.9,5.08 69.9,14.02 71.53,15.65 C20.2
N$40
  Bottom 0.254: R15.1 41.86,23.77 43.89,21.74 56.08,21.74 57.3,22.96 65.84,22.96 68.48,20.32 IC5.3
N$41
  Bottom 0.254: R22.1 11.38,22.96 7.72,22.96 6.5,24.18 LED12.A
N$44
  Top 0.254: IC1.13 22.96,25.4 19.51,28.85 6.5,28.85 3.66,31.7 LED2.K
N$45
  Bottom 0.254: R21.1 7.92,30.48 6.5,31.9 LED2.A
N$46
  Top 0.254: IC1.12 23.98,28.04 21.13,28.04 12.8,36.37 6.5,36.37 3.66,39.22 LED10.K
N$47
  Bottom 0.254: R27.2 11.38,17.68 7.72,17.68 6.5,16.46 LED11.A
N$48
  Bottom 0.254: R28.2 7.92,40.64 6.5,39.22 LED10.A
N$49
  Bottom 0.254: IC1.2 31.9,20.32 34.75,17.48 34.75,12.19 39.01,7.92 56.08,7.92 58.32,10.16 R31.S
N$50
  Bottom 0.254: IC1.3 31.9,22.76 35.36,19.3 35.36,12.39 39.22,8.53 47.35,8.53 48.97,10.16 R32.S
N$51
  Bottom 0.254: R33.S 35.97,14.83 35.97,23.77 31.9,27.84 IC1.5
N$52
  Bottom 0.254: IC1.4 31.09,25.4 29.46,23.77 29.46,20.12 31.7,17.88 IC1.1 31.9,17.68 34.14,15.44 34.14,5.08 R34.E
N$53
  Top 0.254: R31.A 53.24,7.72 49.78,7.72 49.17,7.11 | 49.17,7.11 47.14,5.08 R32.A | IC1.7 31.9,32.92 32.51,32.92 40.03,25.4 40.03,17.48 40.23,17.27 C8.1 40.44,17.07 40.44,15.85 49.17,7.11
  Bottom 0.254: R33.A 40.03,5.08 42.47,2.64 44.5,2.64 46.94,5.08 R32.A | R24.1 33.12,62.18 35.56,59.74 35.56,43.48 33.93,41.86 33.93,34.95 31.9,32.92 IC1.7
PGC
  Bottom 0.254: IC6.27 50.8,54.46 58.52,62.18 PICKIT2.5
PGD
  Bottom 0.254: IC6.28 55.88,60.96 PICKIT2.4
PLLACQ  (via drill 0.61)
  Top 0.254: v40.44,48.97 38.2,48.97 37.19,47.95 37.19,46.74 U1.7 | v48.16,33.93 v54.66,40.44 | v62.38,43.28 71.93,43.28 73.56,44.91 73.56,45.72 IC6.11
  Bottom 0.254: v40.44,48.97 45.92,43.48 45.92,36.58 48.16,34.34 v48.16,33.93 | v54.66,40.44 59.54,40.44 v62.38,43.28
PTT  (via drill 0.61)
  Top 0.254: v38.61,37.39 38.61,38.81 34.95,42.47 17.27,42.47 11.58,48.16 R18.2 | v44.3,33.33 46.13,33.33 v51.61,38.81
  Bottom 0.254: v38.61,37.39 42.67,33.33 v44.3,33.33 | 52.63,39.83 53.44,40.64 53.44,45.72 IC6.3 | v51.61,38.81 52.63,39.83 | 52.63,39.83 58.12,34.34 68.68,34.34 76.2,26.82 R19.1
RCFB  (via drill 0.61)
  Top 0.254: v39.01,47.95 39.01,46.74 U1.10 | R17.2 42.67,31.9 42.67,34.95 C14.2
  Bottom 0.254: v39.01,47.95 39.01,38.61 42.47,35.15 C14.2
RX-232
  Top 0.254: IC6.18 73.56,53.44 73.56,54.46 66.04,61.98 SERIAL.1
RXCLOCK  (via drill 0.61)
  Top 0.254: v47.95,56.69 47.55,56.69 44.7,59.54 39.01,59.54 35.36,55.88 35.36,52.63 U1.21 | v54.46,60.96 57.1,58.32 61.77,58.32 66.04,54.05 IC6.21
  Bottom 0.254: v47.95,56.69 50.6,56.69 54.46,60.55 v54.46,60.96
RXDATA  (via drill 0.61)
  Top 0.254: v36.58,51.21 35.97,51.82 35.97,52.43 U1.20 | v45.92,59.54 52.83,59.54 58.32,54.05 58.32,53.44 IC6.24
  Bottom 0.254: v36.58,51.21 36.58,52.43 41.05,56.9 43.28,56.9 v45.92,59.54
RXDATA/SPKR
  Bottom 0.254: X2.3 87.58,23.98 80.47,16.87 75.39,16.87 74.17,15.65 C20.1
RXDCACQ  (via drill 0.61)
  Top 0.254: v37.57,41.94 36.58,42.55 36.58,46.53 U1.6 | v52.43,29.67 v54.46,31.7 | v62.38,31.7 76.2,45.52 IC6.12
  Bottom 0.254: v37.57,41.94 37.59,33.93 41.86,29.67 v52.43,29.67 | v54.46,31.7 v62.38,31.7
RXHOLD  (via drill 0.61)
  Top 0.254: v39.62,33.53 39.62,38.61 35.97,42.27 35.97,46.53 U1.5 | v51.41,30.68 52.22,30.68 56.9,35.36 v58.32,35.36
  Bottom 0.254: v39.62,33.53 42.88,30.28 51,30.28 v51.41,30.68 | v58.32,35.36 77.01,35.36 79.25,37.59 79.25,45.31 78.84,45.72 IC6.13
RXSIGIN
  Top 0.254: U1.11 39.62,46.53 39.62,40.64 45.11,35.15 C14.1 | R2.2 57.71,24.59 55.07,24.59 47.75,31.9 45.52,31.9 R17.1
  Bottom 0.254: R17.1 45.31,31.9 45.31,34.95 C14.1
RXSN
  Top 0.254: 33.12,56.49 33.12,59.54 R24.2 | 33.12,56.49 33.12,53.85 33.93,53.03 33.93,52.63 U1.23 | 33.12,56.49 17.27,56.49 15.44,58.32 R14.1
TRXPTT
  Bottom 0.254: X2.4 82.5,21.74 Q2.3
TX-232
  Top 0.254: IC6.17 76.2,56.9 71.12,61.98 SERIAL.3
TX/SN  (via drill 0.61)
  Top 0.254: IC6.2 50.8,46.33 55.47,51 63.4,51 64.62,52.22 64.62,54.46 61.98,57.1 v61.77,57.1 | v46.13,61.98 45.11,60.96 38.2,60.96 37.59,60.35 33.93,60.35 33.53,60.76 29.67,60.76 29.26,60.35 19.51,60.35 17.68,62.18 SW4.2
  Bottom 0.254: v61.77,57.1 61.77,60.55 62.59,61.37 62.59,62.59 61.57,63.6 47.75,63.6 v46.13,61.98
TXCLOCK
  Top 0.254: U1.22 34.54,52.63 34.54,55.88 39.01,60.35 45.52,60.35 45.72,60.55 52.63,60.55 57.51,55.68 61.77,55.68 63.4,54.05 63.4,53.44 IC6.22
TXDATA  (via drill 0.61)
  Top 0.254: v36.58,55.88 36.58,52.63 U1.19
  Bottom 0.254: v36.58,55.88 36.58,60.15 33.33,63.4 32.72,63.4 29.67,60.35 28.45,60.35 26.62,62.18 SW3.1 26.62,62.38 20.32,62.38 SW4.1
TXDATA/MIC
  Bottom 0.254: X2.1 87.58,18.49 84.94,18.49 81.48,15.04 C21.2
TXOUT  (via drill 0.61)
  Top 0.254: v39.22,53.85 38.41,53.03 38.41,52.63 U1.16
  Bottom 0.254: v39.22,53.85 42.27,53.85 44.3,55.88 R6.1
USB+
  Top 0.254: IC6.16 78.84,53.24 78.84,52.63 85.14,46.33 88.8,46.33 90.02,47.55 90.02,48.16 J1.D+
USB-
  Bottom 0.254: IC6.15 81.28,53.24 84.73,53.24 86.56,51.41 86.56,49.78 88.19,48.16 J1.D-
VBIAS
  Top 0.254: U1.9 38.41,46.53 38.41,45.11 39.01,44.5 39.01,40.03 40.64,38.41 40.64,27.64 41.86,26.42 R15.2
  Bottom 0.254: R5.2 50.8,26.21 46.33,26.21 C6.1 46.13,26.21 41.86,26.21 R15.2
VCC  (via drill 0.61)
  Top 0.254: IC1.16 24.18,17.88 24.18,20.32 IC1.15 | R27.1 11.38,15.24 9.75,16.87 9.75,23.57 11.58,25.4 R22.2 | C17.2 77.42,32.92 68.48,32.92 IC5.8 59.33,32.11 59.33,38.2 58.32,39.22 R13.1 58.32,39.42 54.46,43.28 47.75,43.28 46.33,44.7 46.33,50.39 45.11,51.61 | 38,51.61 37.8,51.82 37.8,52.43 U1.17 | 38,51.61 38.81,51.61 39.22,52.02 39.22,52.43 U1.15 | 35.15,46.74 34.54,46.74 U1.3 | 33.73,48.16 35.15,46.74 | 33.73,48.16 33.12,48.77 33.12,52.43 U1.24 | 35.15,46.74 U1.4 | 38,51.61 38,51.21 37.8,51 | 37.8,51 34.95,48.16 34.34,48.16 | 34.34,48.16 33.73,48.16 | v34.34,47.95 34.34,48.16 | 50.8,58.32 46.13,53.65 46.13,52.63 45.11,51.61 | 45.11,51.61 44.91,51.41 41.45,51.41 41.05,51 37.8,51 | v53.65,56.08 51.41,58.32 50.8,58.32 | 50.8,58.32 R12.1
  Bottom 0.254: R27.1 16.66,15.24 17.07,14.83 C5.1 17.27,14.63 20.32,17.68 23.98,17.68 IC1.16 | C11.1 11.38,62.18 11.38,54.66 R20.2 13.01,53.03 13.01,44.09 | R22.2 11.58,25.4 13.01,26.82 13.01,31.29 11.38,32.92 R21.2 11.38,33.12 11.38,38 R28.1 11.38,38.2 13.01,39.83 13.01,44.09 | 68.68,53.85 68.68,53.44 IC6.20 68.68,53.85 | 68.68,53.85 75.18,60.35 77.22,60.35 78.64,61.77 78.64,62.18 SW1.2 | R12.1 PICKIT2.2 | 32.11,44.09 32.11,45.72 v34.34,47.95 | 32.11,44.09 32.11,40.84 R25.1 | 68.68,53.85 66.45,56.08 v53.65,56.08 | 13.01,44.09 32.11,44.09
VPP
  Bottom 0.254: PICKIT2.1 48.36,62.18 48.36,58.52 R12.2 46.74,56.9 46.74,47.95 48.16,46.53 48.16,45.72 IC6.1 48.36,45.72 48.36,40.64 PROG.2

### Text on the board
Bottom: USB | RADIO
tPlace: PWR | http://www.gmskhotspot.com | PTT | LOW | MED | HIGH | DCOS | NQSMHS V2.4 | NI2O 02/2011 | COS | DCOS | Low | Medium | High | RX | TX
tNames: Serial #